# EAGLE schematic sim900min (EAGLE 6.2)
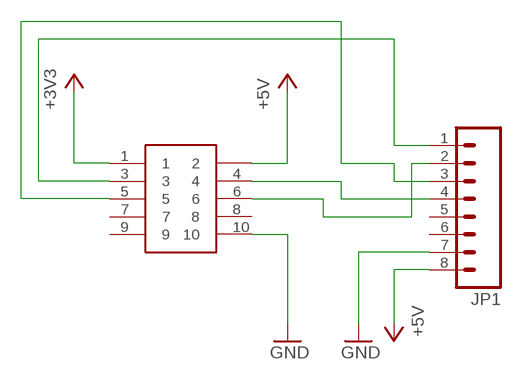
[diagram p0: schematic, sheet 1]

## Parts
JP1  M081X08  [1X08]
U$1  SHF105SM  [SHF105DSM]

## Nets
+3V3: U$1.1
+5V: JP1.8 U$1.2
GND: JP1.7 U$1.10
N$2: JP1.4 U$1.4
N$3: JP1.3 U$1.5
N$4: JP1.2 U$1.6
N$5: JP1.1 U$1.3
Unconnected: JP1.5 JP1.6 U$1.7 U$1.8 U$1.9

## Library data of the parts
JP1 = SparkFun-Connectors:M08: Header 8 Standard 8-pin 0.1" header. Use with straight break away headers (SKU : PRT-00116), right angle break away headers (PRT-00553), swiss pins (PRT-00743), machine pins (PRT-00117), and female headers (PRT-00115).
U$1 = ozlollc:SHF105